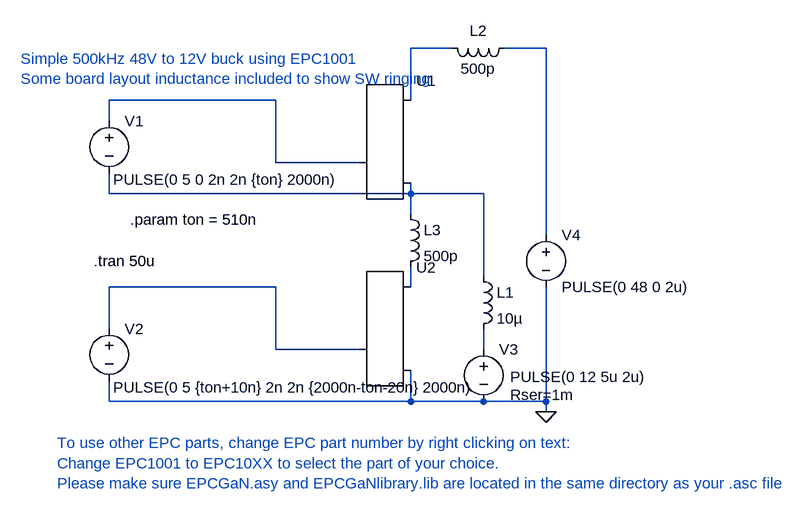
[diagram p0: schematic Example_EPC1001.asc]
Example_EPC1001.asc, the LTspice schematic file:
Version 4
SHEET 1 1932 680
WIRE 1280 -592 1216 -592
WIRE 1424 -592 1360 -592
WIRE 1008 -512 752 -512
WIRE 1216 -512 1216 -592
WIRE 752 -480 752 -512
WIRE 1008 -416 1008 -512
WIRE 1136 -416 1008 -416
WIRE 752 -368 752 -400
WIRE 1216 -368 1216 -384
WIRE 1216 -368 752 -368
WIRE 1328 -368 1216 -368
WIRE 1216 -336 1216 -368
WIRE 1424 -304 1424 -592
WIRE 1328 -240 1328 -368
WIRE 1008 -224 752 -224
WIRE 1216 -224 1216 -256
WIRE 752 -160 752 -224
WIRE 1008 -128 1008 -224
WIRE 1136 -128 1008 -128
WIRE 1328 -128 1328 -160
WIRE 752 -48 752 -80
WIRE 1216 -48 1216 -96
WIRE 1216 -48 752 -48
WIRE 1328 -48 1216 -48
WIRE 1424 -48 1424 -224
WIRE 1424 -48 1328 -48
WIRE 1424 -32 1424 -48
FLAG 1424 -32 0
SYMBOL voltage 752 -496 R0
WINDOW 3 6 106 Left 0
WINDOW 123 0 0 Left 0
SYMATTR Value PULSE(0 5 0 2n 2n {ton} 2000n)
SYMATTR SpiceLine Rser=1
SYMATTR InstName V1
SYMBOL voltage 1424 -320 R0
WINDOW 123 0 0 Left 0
SYMATTR SpiceLine Rser=2m
SYMATTR InstName V4
SYMATTR Value PULSE(0 48 0 2u)
SYMBOL ind 1312 -256 R0
SYMATTR InstName L1
SYMATTR Value 10µ
SYMATTR SpiceLine Rser=15m
SYMBOL voltage 1328 -144 R0
WINDOW 123 0 0 Left 0
WINDOW 39 41 86 Left 0
WINDOW 3 41 58 Left 0
SYMATTR SpiceLine Rser=1m
SYMATTR Value PULSE(0 12 5u 2u)
SYMATTR InstName V3
SYMBOL EPCGaN 1136 -128 R0
WINDOW 3 -81 -29 Left 0
SYMATTR InstName U2
SYMBOL EPCGaN 1136 -416 R0
WINDOW 3 -78 -29 Left 0
SYMATTR InstName U1
SYMBOL voltage 752 -176 R0
WINDOW 3 6 106 Left 0
WINDOW 123 0 0 Left 0
SYMATTR Value PULSE(0 5 {ton+10n} 2n 2n {2000n-ton-20n} 2000n)
SYMATTR SpiceLine Rser=1
SYMATTR InstName V2
SYMBOL ind 1376 -608 R90
WINDOW 0 5 56 VBottom 0
WINDOW 3 32 56 VTop 0
SYMATTR InstName L2
SYMATTR Value 500p
SYMATTR SpiceLine Rpar=10
SYMBOL ind 1200 -352 R0
SYMATTR InstName L3
SYMATTR Value 500p
SYMATTR SpiceLine Rpar=10
TEXT 728 -264 Left 0 !.tran 50u
TEXT 616 -576 Left 0 ;Simple 500kHz 48V to 12V buck using EPC1001\nSome board layout inductance included to show SW ringing
TEXT 672 16 Left 0 ;To use other EPC parts, change EPC part number by right clicking on text:\nChange EPC1001 to EPC10XX to select the part of your choice.\nPlease make sure EPCGaN.asy and EPCGaNlibrary.lib are located in the same directory as your .asc file
TEXT 784 -328 Left 0 !.param ton = 510n

The netlist it stands for:
* Example_EPC1001.asc
V1 N003 N004 PULSE(0 5 0 2n 2n {ton} 2000n) Rser=1
V4 N002 0 PULSE(0 48 0 2u) Rser=2m
L1 N004 N007 10µ Rser=15m
V3 N007 0 PULSE(0 12 5u 2u) Rser=1m
XU2 N005 N006 0 EPCGaN
XU1 N003 N001 N004 EPCGaN
V2 N005 0 PULSE(0 5 {ton+10n} 2n 2n {2000n-ton-20n} 2000n) Rser=1
L2 N002 N001 500p Rpar=10
L3 N004 N006 500p Rpar=10
.tran 50u
* Simple 500kHz 48V to 12V buck using EPC1001
* Some board layout inductance included to show SW ringing
* To use other EPC parts, change EPC part number by right clicking on text:
* Change EPC1001 to EPC10XX to select the part of your choice.
* Please make sure EPCGaN.asy and EPCGaNlibrary.lib are located in the same directory as your .asc file
.param ton = 510n
.backanno
.end